# Altium project Makey Makey V1.0.PrjPcb
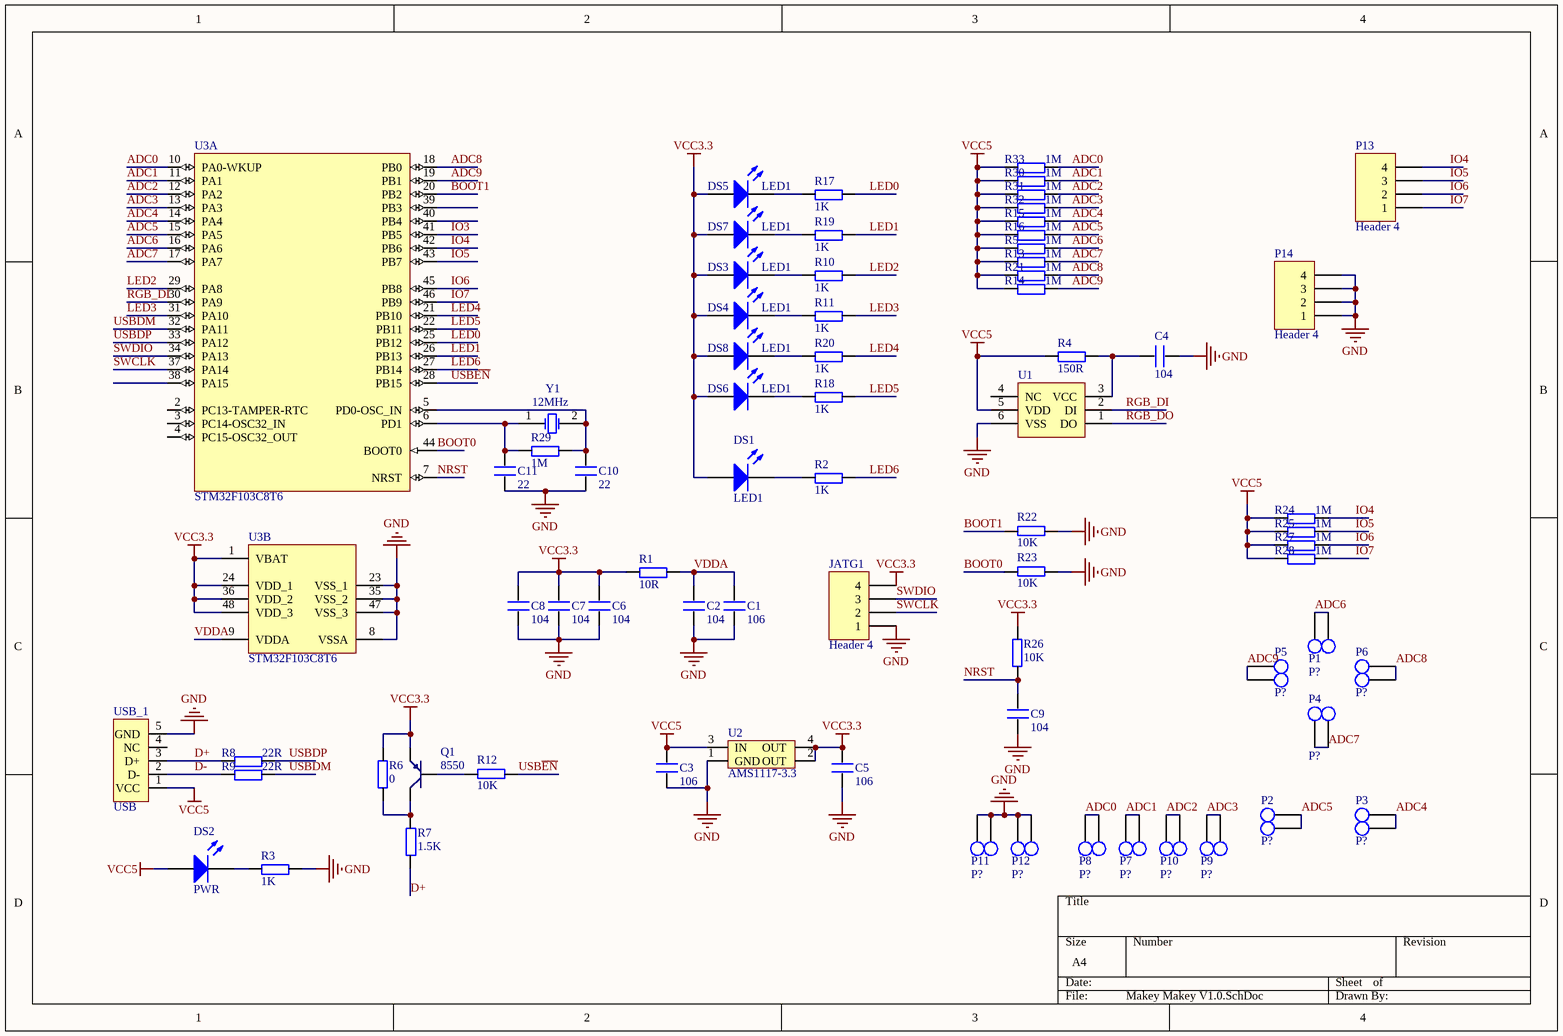
[diagram p0: Makey Makey V1.0.SchDoc]
1 sheet, 73 parts. Net scope: global (net labels, ports and power ports of the same name join across sheets).
Board file: Makey Makey V1.0.PcbDoc

## Sheet Makey Makey V1.0.SchDoc
size A4

### Parts
C1  106  [0603P]
C2  104  [0603P]
C3  106  [0603P]
C4  104  [0603P]
C5  106  [0603P]
C6  104  [0603P]
C7  104  [0603P]
C8  104  [0603P]
C9  104  [0603P]
C10  22  [0603P]
C11  22  [0603P]
DS1  LED1  [SMDLED]
DS2  PWR  [SMDLED]
DS3  LED1  [SMDLED]
DS4  LED1  [SMDLED]
DS5  LED1  [SMDLED]
DS6  LED1  [SMDLED]
DS7  LED1  [SMDLED]
DS8  LED1  [SMDLED]
JATG1  Header 4  [HDR1X4]
P1  P?  [DIP2]
P2  P?  [DIP2R]
P3  P?  [DIP2R]
P4  P?  [DIP2]
P5  P?  [DIP2]
P6  P?  [DIP2]
P7  P?  [DIP2GND]
P8  P?  [DIP2GND]
P9  P?  [DIP2GND]
P10  P?  [DIP2GND]
P11  P?  [DIP2GND]
P12  P?  [DIP2GND]
P13  Header 4  [HDR1X4]
P14  Header 4  [HDR1X4]
Q1  8550  [SOT-23R]
R1  10R  [0603P]
R2  1K  [0603P]
R3  1K  [0603P]
R4  150R  [0603P]
R5  1M  [0603P]
R6  0  [0603P]
R7  1.5K  [0603P]
R8  22R  [0603P]
R9  22R  [0603P]
R10  1K  [0603P]
R11  1K  [0603P]
R12  10K  [0603P]
R13  1M  [0603P]
R14  1M  [0603P]
R15  1M  [0603P]
R16  1M  [0603P]
R17  1K  [0603P]
R18  1K  [0603P]
R19  1K  [0603P]
R20  1K  [0603P]
R21  1M  [0603P]
R22  10K  [0603P]
R23  10K  [0603P]
R24  1M  [0603P]
R25  1M  [0603P]
R26  10K  [0603P]
R27  1M  [0603P]
R28  1M  [0603P]
R29  1M  [0603P]
R30  1M  [0603P]
R31  1M  [0603P]
R32  1M  [0603P]
R33  1M  [0603P]
U1  ?  [WS2812-5050RBG]  (value not drawn)
U2  AMS1117-3.3  [AMS1117]
U3  STM32F103C8T6  [LQFP48_N]  (parts A,B of 2)
USB_1  USB  [USB/SM0.8-6H5]
Y1  12MHz  [XTAL_US]

### Nets
GND: C1.1 C2.1 C3.1 C4.2 C5.1 C6.1 C7.1 C8.1 C9.1 C10.2 C11.2 JATG1.1 P11.1 P11.2 P12.1 P12.2 P14.1 P14.2 P14.3 P14.4 R3.2 R22.1 R23.1 U1.6(VSS) U2.1(GND) U3.8(VSSA) U3.23(VSS_1) U3.35(VSS_2) U3.47(VSS_3) USB_1.5(GND)
VCC3.3: C5.2 C6.2 C7.2 C8.2 DS1.1(A) DS3.1(A) DS4.1(A) DS5.1(A) DS6.1(A) DS7.1(A) DS8.1(A) JATG1.4 Q1.1(E) R1.1 R6.1 R26.1 U2.2(OUT) U2.4(OUT) U3.1(VBAT) U3.24(VDD_1) U3.36(VDD_2) U3.48(VDD_3)
VCC5: C3.2 DS2.1(A) R4.1 R5.1 R13.1 R14.1 R15.1 R16.1 R21.1 R24.1 R25.1 R27.1 R28.1 R30.1 R31.1 R32.1 R33.1 U1.5(VDD) U2.3(IN) USB_1.1(VCC)
ADC0: P8.1 P8.2 R33.2 U3.10(PA0-WKUP)
ADC1: P7.1 P7.2 R30.2 U3.11(PA1)
ADC2: P10.1 P10.2 R31.2 U3.12(PA2)
ADC3: P9.1 P9.2 R32.2 U3.13(PA3)
ADC4: P3.1 P3.2 R15.2 U3.14(PA4)
ADC5: P2.1 P2.2 R16.2 U3.15(PA5)
ADC6: P1.1 P1.2 R5.2 U3.16(PA6)
ADC7: P4.1 P4.2 R13.2 U3.17(PA7)
ADC8: P6.1 P6.2 R21.2 U3.18(PB0)
ADC9: P5.1 P5.2 R14.2 U3.19(PB1)
BOOT0: R23.2 U3.44(BOOT0)
BOOT1: R22.2 U3.20(PB2)
D+: R7.1 R8.1 USB_1.3(D+)
D-: R9.1 USB_1.2(D-)
IO3: U3.41(PB5)
IO4: P13.4 R24.2 U3.42(PB6)
IO5: P13.3 R25.2 U3.43(PB7)
IO6: P13.2 R27.2 U3.45(PB8)
IO7: P13.1 R28.2 U3.46(PB9)
LED0: R17.2 U3.25(PB12)
LED1: R19.2 U3.26(PB13)
LED2: R10.2 U3.29(PA8)
LED3: R11.2 U3.31(PA10)
LED4: R20.2 U3.21(PB10)
LED5: R18.2 U3.22(PB11)
LED6: R2.2 U3.27(PB14)
NRST: C9.2 R26.2 U3.7(NRST)
RGB_DI: U1.2(DI) U3.30(PA9)
RGB_DO: U1.1(DO)
SWCLK: JATG1.2 U3.37(PA14)
SWDIO: JATG1.3 U3.34(PA13)
USBDM: R9.2 U3.32(PA11)
USBDP: R8.2 U3.33(PA12)
USB~{EN}: R12.1 U3.28(PB15)
VDDA: C1.2 C2.2 R1.2 U3.9(VDDA)
NetC4_1: C4.1 R4.2 U1.3(VCC)
NetC10_1: C10.1 R29.2 U3.5(PD0-OSC_IN) Y1.2(OSC2)
NetC11_1: C11.1 R29.1 U3.6(PD1) Y1.1(OSC1)
NetDS1_2: DS1.2(K) R2.1
NetDS2_2: DS2.2(K) R3.1
NetDS3_2: DS3.2(K) R10.1
NetDS4_2: DS4.2(K) R11.1
NetDS5_2: DS5.2(K) R17.1
NetDS6_2: DS6.2(K) R18.1
NetDS7_2: DS7.2(K) R19.1
NetDS8_2: DS8.2(K) R20.1
NetQ1_2: Q1.2(B) R12.2
NetQ1_3: Q1.3(C) R6.2 R7.2

Not connected (* = marked no-connect by the designer): U1 4(NC); U3 2(PC13-TAMPER-RTC) 3(PC14-OSC32_IN) 4(PC15-OSC32_OUT) 38(PA15) 39(PB3) 40(PB4); USB_1 4(NC)

### Library data of the parts
C1-C11 = C
DS1-DS8 = LED2: Typical RED, GREEN, YELLOW, AMBER GaAs LED; Published: 8-Jun-2000; LatestRevisionDate: 17-Jul-2002; LatestRevisionNote: Re-released for DXP Platform.; PackageDocument: Feb-2002; PackageReference: 3.2X1.6X1.1; Publisher: Altium Limited
JATG1 P13 P14 = Header 4: Header, 4-Pin; LatestRevisionDate: 17-Jul-2002; LatestRevisionNote: Re-released for DXP Platform.; Publisher: Altium Limited
P1-P12 = DIP2
Q1 = PNP: 8550/BCW68
R1-R33 = R
U1 = WS2812-5050RGB
U2 = AMS1117
U3 = STM32F103C8T6: STM32 ARM-based 32-bit MCU Performance Line with 64 kB Flash, 20 kB Internal RAM, -40 to +85°C Temperature, 48-Pin LQFP, Tray; DatasheetVersion: rev13.0, Apr-2011; PackageVersion: rev13, Apr-2011; PackageReference: LQFP48; PackageDescription: 48-Pin Low-Profile Quad Flat Pack, 7 x 7 mm Body, 0.5 mm Pitch (LQFP48); ComponentLink1Description: Manufacturer URL; ComponentLink1URL: http://www.st.com/; ComponentLink2Description: STM32F103 Datasheet; ComponentLink2URL: http://www.st.com/internet/com/TECHNICAL_RESOURCES/TECHNICAL_LITERATURE/DATASHEET/CD00161566.pdf; ComponentLink3Description: STM32 Family Web Page; ComponentLink3URL: www.st.com/stm32
USB_1 = USB5
Y1 = XTAL: Crystal Oscillator; Published: 8-Jun-2000; LatestRevisionDate: 17-Jul-2002; LatestRevisionNote: Re-released for DXP Platform.; Publisher: Altium Limited